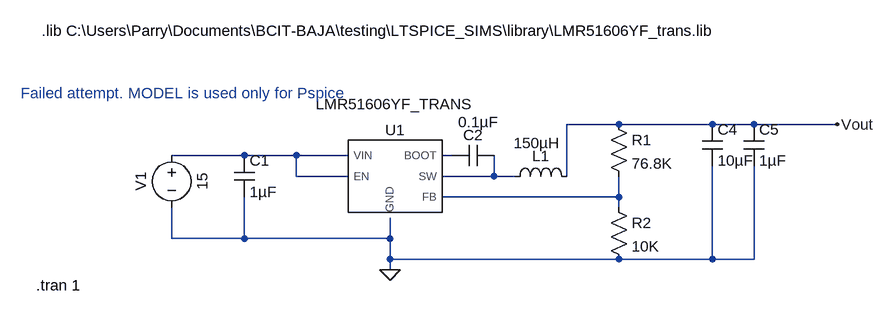
[diagram p0: schematic Draft1.asc]
Draft1.asc, the LTspice schematic file:
Version 4.1
SHEET 1 1304 680
WIRE 896 352 816 352
WIRE 1040 352 896 352
WIRE 1104 352 1040 352
WIRE 1232 352 1104 352
WIRE 320 400 208 400
WIRE 400 400 320 400
WIRE 480 400 400 400
WIRE 640 400 624 400
WIRE 400 432 400 400
WIRE 480 432 400 432
WIRE 704 432 704 400
WIRE 704 432 624 432
WIRE 736 432 704 432
WIRE 816 432 816 352
WIRE 896 464 896 432
WIRE 896 464 624 464
WIRE 896 480 896 464
WIRE 208 528 208 480
WIRE 320 528 320 464
WIRE 320 528 208 528
WIRE 544 528 544 496
WIRE 544 528 320 528
WIRE 544 560 544 528
WIRE 896 560 544 560
WIRE 1040 560 1040 416
WIRE 1040 560 896 560
WIRE 1104 560 1104 416
WIRE 1104 560 1040 560
WIRE 544 576 544 560
FLAG 544 576 0
FLAG 1232 352 Vout
SYMBOL voltage 208 384 R0
WINDOW 0 -32 56 VBottom 2
WINDOW 3 32 56 VTop 2
WINDOW 123 0 0 Left 0
WINDOW 39 0 0 Left 0
SYMATTR InstName V1
SYMATTR Value 15
SYMBOL cap 304 400 R0
SYMATTR InstName C1
SYMATTR Value 1µF
SYMBOL cap 704 384 R90
WINDOW 0 0 32 VBottom 2
WINDOW 3 -51 24 VTop 2
SYMATTR InstName C2
SYMATTR Value 0.1µF
SYMBOL ind 720 448 R270
WINDOW 0 32 56 VTop 2
WINDOW 3 83 50 VBottom 2
SYMATTR InstName L1
SYMATTR Value 150µH
SYMBOL res 880 336 R0
SYMATTR InstName R1
SYMATTR Value 76.8K
SYMBOL res 880 464 R0
SYMATTR InstName R2
SYMATTR Value 10K
SYMBOL cap 1024 352 R0
SYMATTR InstName C4
SYMATTR Value 10µF
SYMBOL cap 1088 352 R0
SYMATTR InstName C5
SYMATTR Value 1µF
SYMBOL library\\LMR51606YF_TRANS 544 432 R0
SYMATTR InstName U1
TEXT 8 208 Left 2 !.lib C:\\Users\\Parry\\Documents\\BCIT-BAJA\\testing\\LTSPICE_SIMS\\library\\LMR51606YF_trans.lib
TEXT 0 600 Left 2 !.tran 1
TEXT -24 304 Left 2 ;Failed attempt. MODEL is used only for Pspice

The netlist it stands for:
* Draft1.asc
V1 N001 0 15
C1 N001 0 1µF
C2 N003 N002 0.1µF
L1 N003 Vout 150µH
R1 Vout N004 76.8K
R2 N004 0 10K
C4 Vout 0 10µF
C5 Vout 0 1µF
X§U1 N002 N001 N004 0 N003 N001 LMR51606YF_TRANS  ; pins BOOT EN FB GND SW VIN
.lib C:\Users\Parry\Documents\BCIT-BAJA\testing\LTSPICE_SIMS\library\LMR51606YF_trans.lib
.tran 1
* Failed attempt. MODEL is used only for Pspice
.lib C:\Users\Parry\Documents\BCIT-BAJA\testing\LTSPICE_SIMS\library\LMR51606YF_trans.lib
.backanno
.end